# Altium project PCB-Tester-Board.PrjPcb (part 1 of 4)
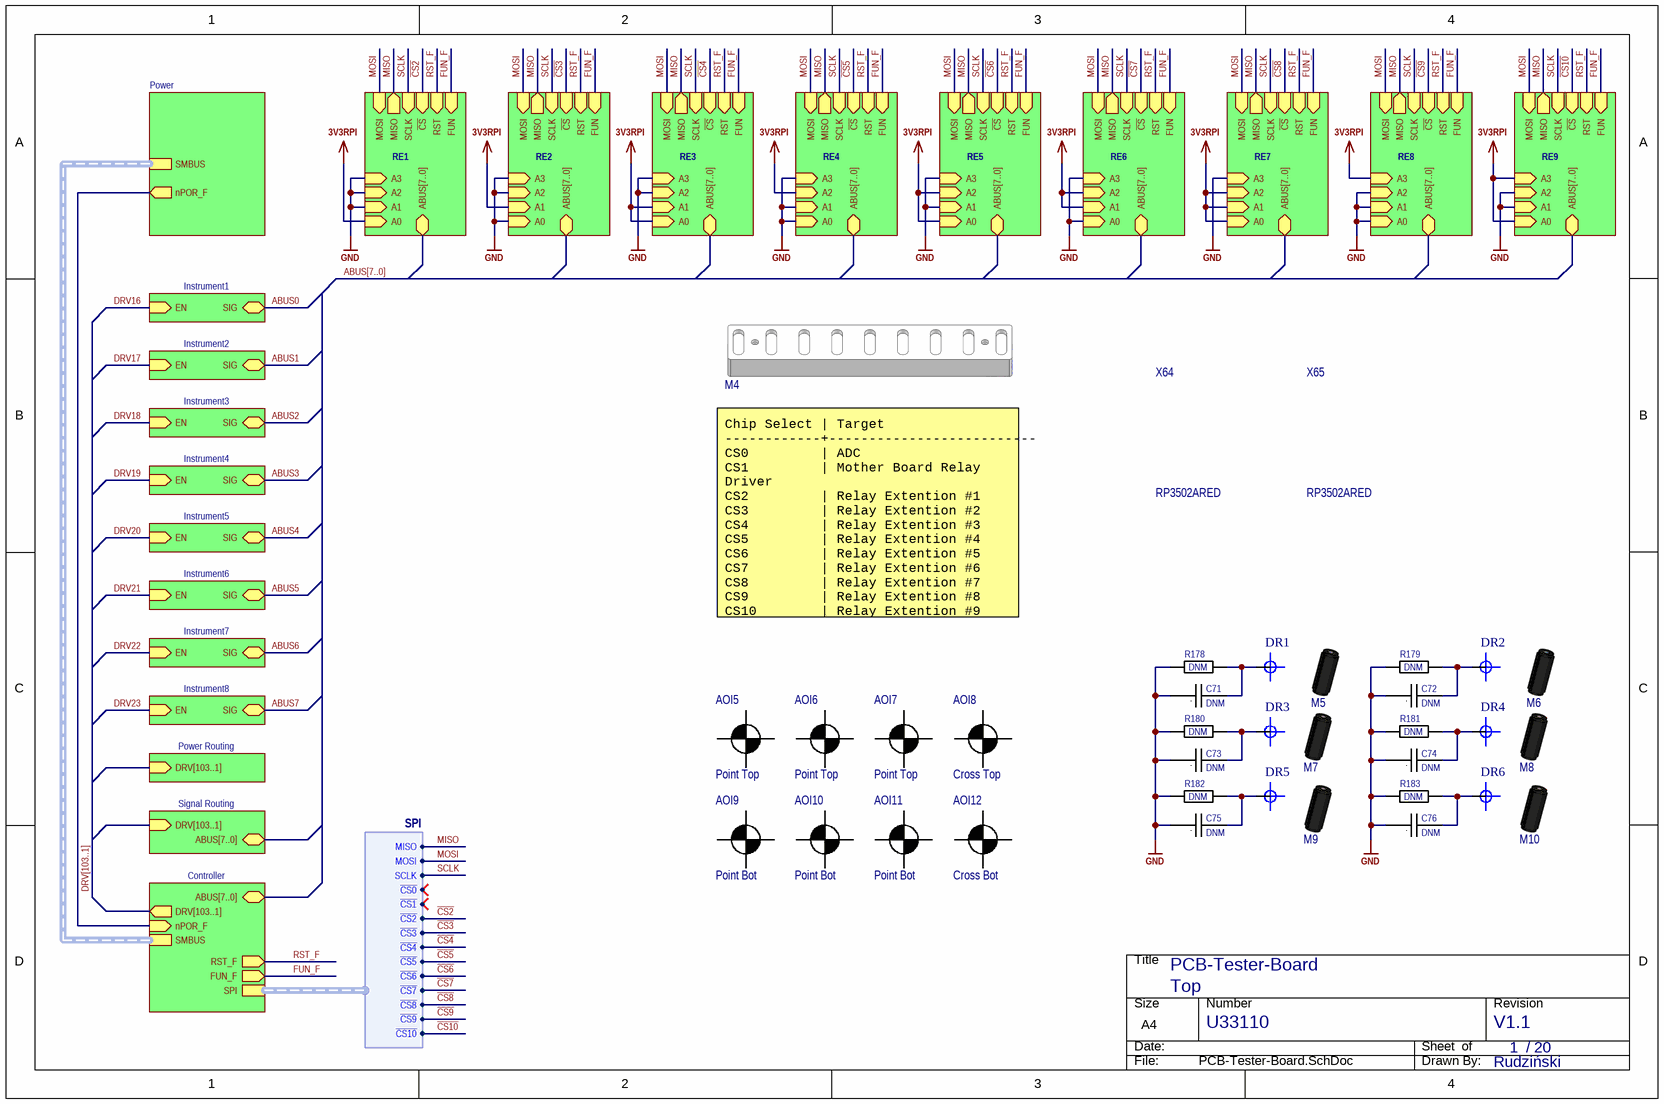
[diagram p0: PCB-Tester-Board.SchDoc]
Project_Team: Semi-ATE; Project_Revision: V1.1; Project_Repository: https://github.com/Semi-ATE/PCB-Tester; Project_Number: U33110; Project_Name: PCB-Tester-Board; Project_Engineer: Hören; Project_DrawnBy: Rudziński; Project_CheckedBy: Mörz
20 sheets, 790 parts. Net scope: hierarchical (ports join the sheet entries above them; power ports are global).
Board file: PCB-Tester-Board.PcbDoc
Sheets:
  PCB-Tester-Board.SchDoc
    Instrument1 = Instrument.SchDoc
    Instrument2 = Instrument.SchDoc
    Instrument3 = Instrument.SchDoc
    Instrument4 = Instrument.SchDoc
    Instrument5 = Instrument.SchDoc
    Instrument6 = Instrument.SchDoc
    Instrument7 = Instrument.SchDoc
    Instrument8 = Instrument.SchDoc
    Power = Power.SchDoc
      PSU2 = PSU2.SchDoc
      PSU1 = PSU1.SchDoc
      PSU3 = PSU3.SchDoc
      DC Cable = DC-Cable.SchDoc
      AC Cables = AC-Cable.SchDoc
    RE2 = RelayExtension.SchDoc
    Controller = Controller.SchDoc
      ADC = ADC.SchDoc
      RelayDriver = RelayDriver.SchDoc
        X7A15T-Prog = X7A15T-Prog.SchDoc
        X7A15T-Fabric = X7A15T-Fabric.SchDoc
        X7A15T-Power = X7A15T-Power.SchDoc
          X7A15T-Decoupling = X7A15T-Decoupling.SchDoc
      Input = Input.SchDoc
      Output = Output.SchDoc
      Output = Output.SchDoc
      Output = Output.SchDoc
      Output = Output.SchDoc
      Output = Output.SchDoc
      Input = Input.SchDoc
      Input = Input.SchDoc
      Input = Input.SchDoc
      Input = Input.SchDoc
    RE3 = RelayExtension.SchDoc
    RE4 = RelayExtension.SchDoc
    RE5 = RelayExtension.SchDoc
    RE6 = RelayExtension.SchDoc
    RE7 = RelayExtension.SchDoc
    RE8 = RelayExtension.SchDoc
    RE1 = RelayExtension.SchDoc
    RE9 = RelayExtension.SchDoc
    Power Routing = PowerRouting.SchDoc
    Signal Routing = SignalRouting.SchDoc

## Sheet PCB-Tester-Board.SchDoc: Top
size A4; Date: JUN 2020; ApprovedBy: Hören; CheckedBy: Mörz; Author: Rudziński; CompanyName: Semi-ATE; DrawnBy: Rudziński; Engineer: Hören; Organization: Semi-ATE; DocumentNumber: 1; Revision: V1.0; SheetNumber: 1; SheetTotal: 20

### Parts
AOI5  Shape: Point Top  [Fiducial Point]  (hidden comment: AOI)  (no BOM)
AOI6  Shape: Point Top  [Fiducial Point]  (hidden comment: AOI)  (no BOM)
AOI7  Shape: Point Top  [Fiducial Point]  (hidden comment: AOI)  (no BOM)
AOI8  Shape: Cross Top  [Fiducial Cross]  (hidden comment: AOI)  (no BOM)
AOI9  Shape: Point Bot  [Fiducial Point]  (hidden comment: AOI)  (no BOM)
AOI10  Shape: Point Bot  [Fiducial Point]  (hidden comment: AOI)  (no BOM)
AOI11  Shape: Point Bot  [Fiducial Point]  (hidden comment: AOI)  (no BOM)
AOI12  Shape: Cross Bot  [Fiducial Cross]  (hidden comment: AOI)  (no BOM)
C71  value DNM  [C1206 Reflow]  (hidden comment: C)  (no BOM)
C72  value DNM  [C1206 Reflow]  (hidden comment: C)  (no BOM)
C73  value DNM  [C1206 Reflow]  (hidden comment: C)  (no BOM)
C74  value DNM  [C1206 Reflow]  (hidden comment: C)  (no BOM)
C75  value DNM  [C1206 Reflow]  (hidden comment: C)  (no BOM)
C76  value DNM  [C1206 Reflow]  (hidden comment: C)  (no BOM)
DR1  X  [HOLE_3.4mm]  (value not drawn)  (no BOM)
DR2  X  [HOLE_3.4mm]  (value not drawn)  (no BOM)
DR3  X  [HOLE_3.4mm]  (value not drawn)  (no BOM)
DR4  X  [HOLE_3.4mm]  (value not drawn)  (no BOM)
DR5  X  [HOLE_3.4mm]  (value not drawn)  (no BOM)
DR6  X  [HOLE_3.4mm]  (value not drawn)  (no BOM)
M4  M  (value not drawn)  (mechanical)
M5  M  [970180155]  (value not drawn)
M6  M  [970180155]  (value not drawn)
M7  M  [970180155]  (value not drawn)
M8  M  [970180155]  (value not drawn)
M9  M  [970180155]  (value not drawn)
M10  M  [970180155]  (value not drawn)
R178  value DNM  [R1206 Reflow]  (hidden comment: R)  (no BOM)
R179  value DNM  [R1206 Reflow]  (hidden comment: R)  (no BOM)
R180  value DNM  [R1206 Reflow]  (hidden comment: R)  (no BOM)
R181  value DNM  [R1206 Reflow]  (hidden comment: R)  (no BOM)
R182  value DNM  [R1206 Reflow]  (hidden comment: R)  (no BOM)
R183  value DNM  [R1206 Reflow]  (hidden comment: R)  (no BOM)
X64  X  (value not drawn)
X65  X  (value not drawn)

### Sub-sheets
Controller = Controller.SchDoc: ABUS[7..0] (bidir), SPI (harness SPI), DRV[103..1] (out), SMBUS (harness SMBUS), nPOR_F (in), FUN_F (out), RST_F (out)
Instrument1 = Instrument.SchDoc: EN (in), SIG (bidir)
Instrument2 = Instrument.SchDoc: EN (in), SIG (bidir)
Instrument3 = Instrument.SchDoc: EN (in), SIG (bidir)
Instrument4 = Instrument.SchDoc: EN (in), SIG (bidir)
Instrument5 = Instrument.SchDoc: EN (in), SIG (bidir)
Instrument6 = Instrument.SchDoc: EN (in), SIG (bidir)
Instrument7 = Instrument.SchDoc: EN (in), SIG (bidir)
Instrument8 = Instrument.SchDoc: EN (in), SIG (bidir)
Power = Power.SchDoc: SMBUS (harness SMBUS), nPOR_F (out)
Power Routing = PowerRouting.SchDoc: DRV[103..1] (in)
RE1 = RelayExtension.SchDoc: ABUS[7..0] (bidir), SCLK (in), ~{CS} (in), MISO (out), MOSI (in), A3 (in), A2 (in), A1 (in), A0 (in), RST (in), FUN (in)
RE2 = RelayExtension.SchDoc: ABUS[7..0] (bidir), MOSI (in), MISO (out), ~{CS} (in), SCLK (in), A2 (in), A3 (in), A1 (in), A0 (in), RST (in), FUN (in)
RE3 = RelayExtension.SchDoc: ABUS[7..0] (bidir), MISO (out), SCLK (in), ~{CS} (in), MOSI (in), A2 (in), A3 (in), A1 (in), A0 (in), RST (in), FUN (in)
RE4 = RelayExtension.SchDoc: ABUS[7..0] (bidir), ~{CS} (in), SCLK (in), MOSI (in), MISO (out), A0 (in), A1 (in), A2 (in), A3 (in), RST (in), FUN (in)
RE5 = RelayExtension.SchDoc: ABUS[7..0] (bidir), SCLK (in), MISO (out), MOSI (in), ~{CS} (in), A3 (in), A2 (in), A1 (in), A0 (in), RST (in), FUN (in)
RE6 = RelayExtension.SchDoc: ABUS[7..0] (bidir), MOSI (in), ~{CS} (in), MISO (out), SCLK (in), A3 (in), A0 (in), A1 (in), A2 (in), RST (in), FUN (in)
RE7 = RelayExtension.SchDoc: ABUS[7..0] (bidir), MOSI (in), SCLK (in), MISO (out), ~{CS} (in), A0 (in), A1 (in), A2 (in), A3 (in), RST (in), FUN (in)
RE8 = RelayExtension.SchDoc: ABUS[7..0] (bidir), MOSI (in), MISO (out), ~{CS} (in), SCLK (in), A3 (in), A2 (in), A1 (in), A0 (in), RST (in), FUN (in)
RE9 = RelayExtension.SchDoc: ABUS[7..0] (bidir), MISO (out), SCLK (in), MOSI (in), ~{CS} (in), A3 (in), A2 (in), A1 (in), A0 (in), RST (in), FUN (in)
Signal Routing = SignalRouting.SchDoc: ABUS[7..0] (bidir), DRV[103..1] (in)

### Harnesses
SPI: MISO, MOSI, SCLK, ~{CS0}, ~{CS1}, ~{CS2}, ~{CS3}, ~{CS4}, ~{CS5}, ~{CS6}, ~{CS7}, ~{CS8}, ~{CS9}, ~{CS10}

### Nets
3V3RPI: sheet RE2/A1, sheet RE3/A1, sheet RE3/A0, sheet RE4/A2, sheet RE5/A2, sheet RE5/A0, sheet RE6/A1, sheet RE6/A2, sheet RE7/A0, sheet RE7/A1, sheet RE7/A2, sheet RE8/A3, sheet RE1/A0, sheet RE9/A3, sheet RE9/A0
GND: C71.1 C72.1 C73.1 C74.1 C75.1 C76.1 R178.2 R179.2 R180.2 R181.2 R182.2 R183.2 ; sheet RE2/A2, sheet RE2/A3, sheet RE2/A0, sheet RE3/A2, sheet RE3/A3, sheet RE4/A0, sheet RE4/A1, sheet RE4/A3, sheet RE5/A3, sheet RE5/A1, sheet RE6/A3, sheet RE6/A0, sheet RE7/A3, sheet RE8/A2, sheet RE8/A1, sheet RE8/A0, sheet RE1/A3, sheet RE1/A2, sheet RE1/A1, sheet RE9/A2, sheet RE9/A1
~{CS2}: sheet RE1/~{CS}, sheet Controller/SPI.~{CS2}
~{CS3}: sheet RE2/~{CS}, sheet Controller/SPI.~{CS3}
~{CS4}: sheet RE3/~{CS}, sheet Controller/SPI.~{CS4}
~{CS5}: sheet RE4/~{CS}, sheet Controller/SPI.~{CS5}
~{CS6}: sheet RE5/~{CS}, sheet Controller/SPI.~{CS6}
~{CS7}: sheet RE6/~{CS}, sheet Controller/SPI.~{CS7}
~{CS8}: sheet RE7/~{CS}, sheet Controller/SPI.~{CS8}
~{CS9}: sheet RE8/~{CS}, sheet Controller/SPI.~{CS9}
~{CS10}: sheet RE9/~{CS}, sheet Controller/SPI.~{CS10}
FUN_F: sheet RE2/FUN, sheet Controller/FUN_F, sheet RE3/FUN, sheet RE4/FUN, sheet RE5/FUN, sheet RE6/FUN, sheet RE7/FUN, sheet RE8/FUN, sheet RE1/FUN, sheet RE9/FUN
MISO: sheet RE2/MISO, sheet RE3/MISO, sheet RE4/MISO, sheet RE5/MISO, sheet RE6/MISO, sheet RE7/MISO, sheet RE8/MISO, sheet RE1/MISO, sheet RE9/MISO, sheet Controller/SPI.MISO
MOSI: sheet RE2/MOSI, sheet RE3/MOSI, sheet RE4/MOSI, sheet RE5/MOSI, sheet RE6/MOSI, sheet RE7/MOSI, sheet RE8/MOSI, sheet RE1/MOSI, sheet RE9/MOSI, sheet Controller/SPI.MOSI
nRST: sheet Power/nPOR_F, sheet Controller/nPOR_F
RST_F: sheet RE2/RST, sheet Controller/RST_F, sheet RE3/RST, sheet RE4/RST, sheet RE5/RST, sheet RE6/RST, sheet RE7/RST, sheet RE8/RST, sheet RE1/RST, sheet RE9/RST
SCLK: sheet RE2/SCLK, sheet RE3/SCLK, sheet RE4/SCLK, sheet RE5/SCLK, sheet RE6/SCLK, sheet RE7/SCLK, sheet RE8/SCLK, sheet RE1/SCLK, sheet RE9/SCLK, sheet Controller/SPI.SCLK
NetC71_2: C71.2 DR1.1(OUT3) R178.1
NetC72_2: C72.2 DR2.1(OUT3) R179.1
NetC73_2: C73.2 DR3.1(OUT3) R180.1
NetC74_2: C74.2 DR4.1(OUT3) R181.1
NetC75_2: C75.2 DR5.1(OUT3) R182.1
NetC76_2: C76.2 DR6.1(OUT3) R183.1

### Buses and harness runs
bus ABUS[7..0] = sheet Controller/ABUS[7..0] = sheet RE1/ABUS[7..0] = sheet RE2/ABUS[7..0] = sheet RE3/ABUS[7..0] = sheet RE4/ABUS[7..0] = sheet RE5/ABUS[7..0] = sheet RE6/ABUS[7..0] = sheet RE7/ABUS[7..0] = sheet RE8/ABUS[7..0] = sheet RE9/ABUS[7..0] = sheet Signal Routing/ABUS[7..0]
bus DRV[103..1] = sheet Controller/DRV[103..1] = sheet Power Routing/DRV[103..1] = sheet Signal Routing/DRV[103..1]
harness sheet Controller/SMBUS = sheet Power/SMBUS

### Notes on the sheet
- (near M4) Chip Select | Target
  ------------+--------------------------
  CS0         | ADC
  CS1         | Mother Board Relay Driver
  CS2         | Relay Extention #1
  CS3         | Relay Extention #2
  CS4         | Relay Extention #3
  CS5         | Relay Extention #4
  CS6         | Relay Extention #5
  CS7         | Relay Extention #6
  CS8         | Relay Extention #7
  CS9         | Relay Extention #8
  CS10        | Relay Extention #9
- /
- designed by
- reviewed by
- last drawn by
- Project:
- Schematic:
- last printed
- DIN-A4 L
- sheets
- of
- File:
- (in symbol C) .

### Library data of the parts
AOI5-AOI12 = Fiducial: Assembly AOI; 13. Created Date/Name: AUG2018/Hören; 01. Distributor: N/A; 02. Distributor Part Number: N/A; 03. Unit Price: N/A; 04. Manufacturer: N/A; 05. Quantity: N/A; 06. Data Sheet: N/A; 07. Manufacturer  Part Number: N/A; 08. Inhouse Stock: N/A; 09. Operating Temperature: N/A; 10. Weight: N/A; 11. RoHS: N/A; 12.UL94 Flammability: N/A; ComponentLink1Description: Info; ComponentLink2Description: Info
C71-C76 = C: Capacitor Unpolarized; Tolerance: ±20%; 13. Created Date/Name: AUG2018/Hören; ComponentLink1Description: Info; ComponentLink1URL: *; 09. Operating Temperature: -xx..+yy°C; 11. RoHS: ???; ComponentLink2Description: DataSheet
DR1-DR6 = Drill-3.2mm-M3-C: Fiducal 90 mil; POPULATED: no part
M4 = Support Block: 03. Unit Price: 2.0; 13. Created Date/Name: ??? / Hören; System: Connector; 01. Distributor: Likom; 02. Distributor Part Number: N/A; 04. Manufacturer: N/A; 07. Manufacturer  Part Number: N/A; ComponentLink1Description: Info; ComponentLink2Description: DataSheet
M5-M10 = Spacer 18mm Plastic: PLASTIC SPACER STUD METRIC THREA; 04. Manufacturer: Würth Elektronik; 03. Unit Price: 0.92; 13. Created Date/Name: ??? / Hören; System: Connector; 01. Distributor: DigiKey; 02. Distributor Part Number: 732-13017-ND; 07. Manufacturer  Part Number: 970180155; ComponentLink1Description: Info; ComponentLink1URL: https://www.digikey.de/products/de?keywords=970180155; ComponentLink2Description: DataSheet; ComponentLink2URL: https://www.we-online.de/katalog/datasheet/970xxxxxx_overall.pdf
R178-R183 = R: Resistor; Tolerance: ±1%; 13. Created Date/Name: AUG2018/Hören; ComponentLink1URL: *; ComponentLink1Description: Info; 09. Operating Temperature: -xx..+yy°C; 11. RoHS: ???; ComponentLink2Description: DataSheet; Package: *
X64 X65 = RP3502ARED: SWITCH PUSH SPST-NO 3A 120V; 04. Manufacturer: E-Switch; 03. Unit Price: 1.54; 13. Created Date/Name: AUG 2018 / Hören; 01. Distributor: DigiKey; 02. Distributor Part Number: EG1930-ND; 11. RoHS: YES; ComponentLink1Description: Info; ComponentLink1URL: https://www.digikey.de/product-detail/en/e-switch/RP3502ARED/EG1930-ND/280448; ComponentLink2Description: DataSheet; ComponentLink2URL: https://media.digikey.com/pdf/Data%20Sheets/E-Switch%20PDFs/RP3502_Series.pdf; 07. Manufacturer  Part Number: RP3502ARED

## Sheet Instrument.SchDoc: Instrument
size A4; Date: JUN 2020; ApprovedBy: Hören; CheckedBy: Mörz; Author: Rudziński; CompanyName: Semi-ATE; DrawnBy: Rudziński; Engineer: Hören; Organization: Semi-ATE; DocumentNumber: 3; Revision: V1.0; SheetNumber: 3; SheetTotal: 20
Used 8 times, as channels Instrument1, Instrument2, Instrument3, Instrument4, Instrument5, Instrument6, Instrument7, Instrument8. Parts and nets are listed once, with the designators drawn on the sheet.
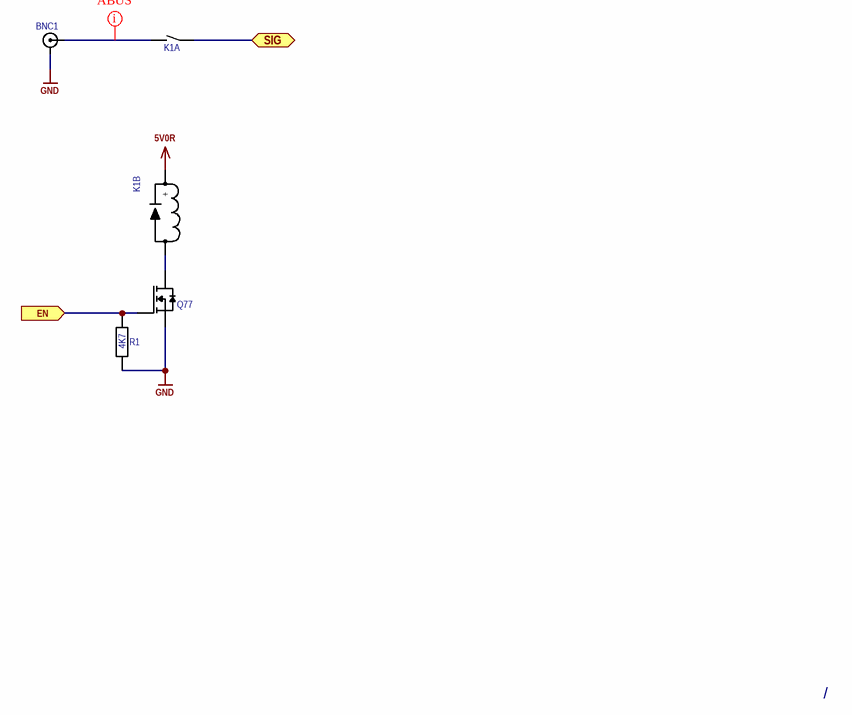
[diagram p1: Instrument.SchDoc]

### Parts
BNC1  X  [BNC]  (value not drawn)
K1  K  [118-1A]  (value not drawn)  (parts A,B of 2)
Q77  Q  [SOT23-3]  (value not drawn)
R1  value 4K7  [R0603 Reflow]  (hidden comment: R)

### Ports
EN (in), SIG (bidir)

### Nets
5V0R: K1.1(+)
GND: BNC1.0 Q77.2(S) R1.1
EN: Q77.1(G) R1.2 ; port EN
SIG: K1.4(CB) ; port SIG
NetBNC1_1: BNC1.1 K1.3(CA)
NetK1_2: K1.2(-) Q77.3(D)

### Channels
Instrument1: designators end in _1; ports EN=DRV16 SIG=ABUS0
Instrument2: designators end in _2; ports EN=DRV17 SIG=ABUS1
Instrument3: designators end in _3; ports EN=DRV18 SIG=ABUS2
Instrument4: designators end in _4; ports EN=DRV19 SIG=ABUS3
Instrument5: designators end in _5; ports EN=DRV20 SIG=ABUS4
Instrument6: designators end in _6; ports EN=DRV21 SIG=ABUS5
Instrument7: designators end in _7; ports EN=DRV22 SIG=ABUS6
Instrument8: designators end in _8; ports EN=DRV23 SIG=ABUS7

### Layout directives
net class ABUS: NetBNC1_1_1

### Notes on the sheet
- /
- designed by
- reviewed by
- last drawn by
- Project:
- Schematic:
- last printed
- DIN-A4 L
- sheets
- of
- File:

### Library data of the parts
BNC1 = BNC: BNC Connector; 04. Manufacturer: Amphenol RF; 07. Manufacturer  Part Number: 112778; 03. Unit Price: 11.91; 13. Created Date/Name: AUG 2018 / Hören; ComponentLink1Description: Info; 02. Distributor Part Number: ACX1985-ND; 01. Distributor: DigiKey; ComponentLink2Description: DataSheet; ComponentLink3Description: FootPrint; System: Connector
K1 = 118-1-A-5/2D: 5V Signal Relais, Normal Open; 04. Manufacturer: Pickering; 03. Unit Price: 2.60; 05. Quantity: 1000; 06. Data Sheet: Pickering_series_118.pdf; 13. Created Date/Name: 20.12.17 S. Kaiser; Coil Resistance: 1500 Ohm; Max Carry Current: 1.2 A; Max Switch Current: 1A; Max Switch Voltage: 200V; Power Rating: 15W; 01. Distributor: Pickering; 02. Distributor Part Number: 118-1-A-5/2D; 07. Manufacturer  Part Number: 118-1-A-5/2D; 09. Operating Temperature: -20°C ~ +85°C; 11. RoHS: 2011/65/EU; ComponentLink1Description: Info; ComponentLink1URL: http://www.pickeringrelay.com/; ComponentLink2Description: DataSheet; ComponentLink2URL: https://www.pickeringrelay.com/products/single-line-sil-series-111-119/single-line-sil-series-118/; Coil Voltage: 5V
Q77 = FDV303N: MOSFET N-CH 25V 680MA SOT-23; 04. Manufacturer: ON Semiconductor; 03. Unit Price: 0.41; 13. Created Date/Name: AUG 2018 / Hören; Rds On: 450 mΩ @ id=500mA & Vgs=4.5V; Vgs,th: 1.5V @ 250uA; Power Rating: 350mW; 3D-Export: No; 01. Distributor: DigiKey; 02. Distributor Part Number: FDV303NDKR-ND; 07. Manufacturer  Part Number: FDV303N; 09. Operating Temperature: -55°C ~ 150°C (TJ); 11. RoHS: YES; ComponentLink1Description: Info; ComponentLink1URL: https://www.digikey.de/product-detail/en/on-semiconductor/FDV303N/FDV303NDKR-ND/1630434; ComponentLink2Description: DataSheet; ComponentLink2URL: https://media.digikey.com/pdf/Data%20Sheets/Fairchild%20PDFs/FDV303N.pdf; Vdss: 25V; Id: 680mA
R1 = R: RES SMD 4.7K OHM 1% 1/10W 0603; 04. Manufacturer: Yageo; 07. Manufacturer  Part Number: RC0603FR-074K7L; 03. Unit Price: 0.09; 13. Created Date/Name: AUG2018/Hören; Tolerance: ±1%; ComponentLink1URL: *; ComponentLink1Description: Info; 02. Distributor Part Number: 311-4.70KHRCT-ND; 09. Operating Temperature: -xx..+yy°C; 11. RoHS: ???; 01. Distributor: DigiKey; ComponentLink2Description: DataSheet; Package: *

## Sheet Power.SchDoc: Power
size A4; Date: JUN 2020; ApprovedBy: Hören; CheckedBy: Mörz; Author: Rudziński; CompanyName: Semi-ATE; DrawnBy: Rudziński; Engineer: Hören; Organization: Semi-ATE; DocumentNumber: 4; Revision: V1.0; SheetNumber: 4; SheetTotal: 20
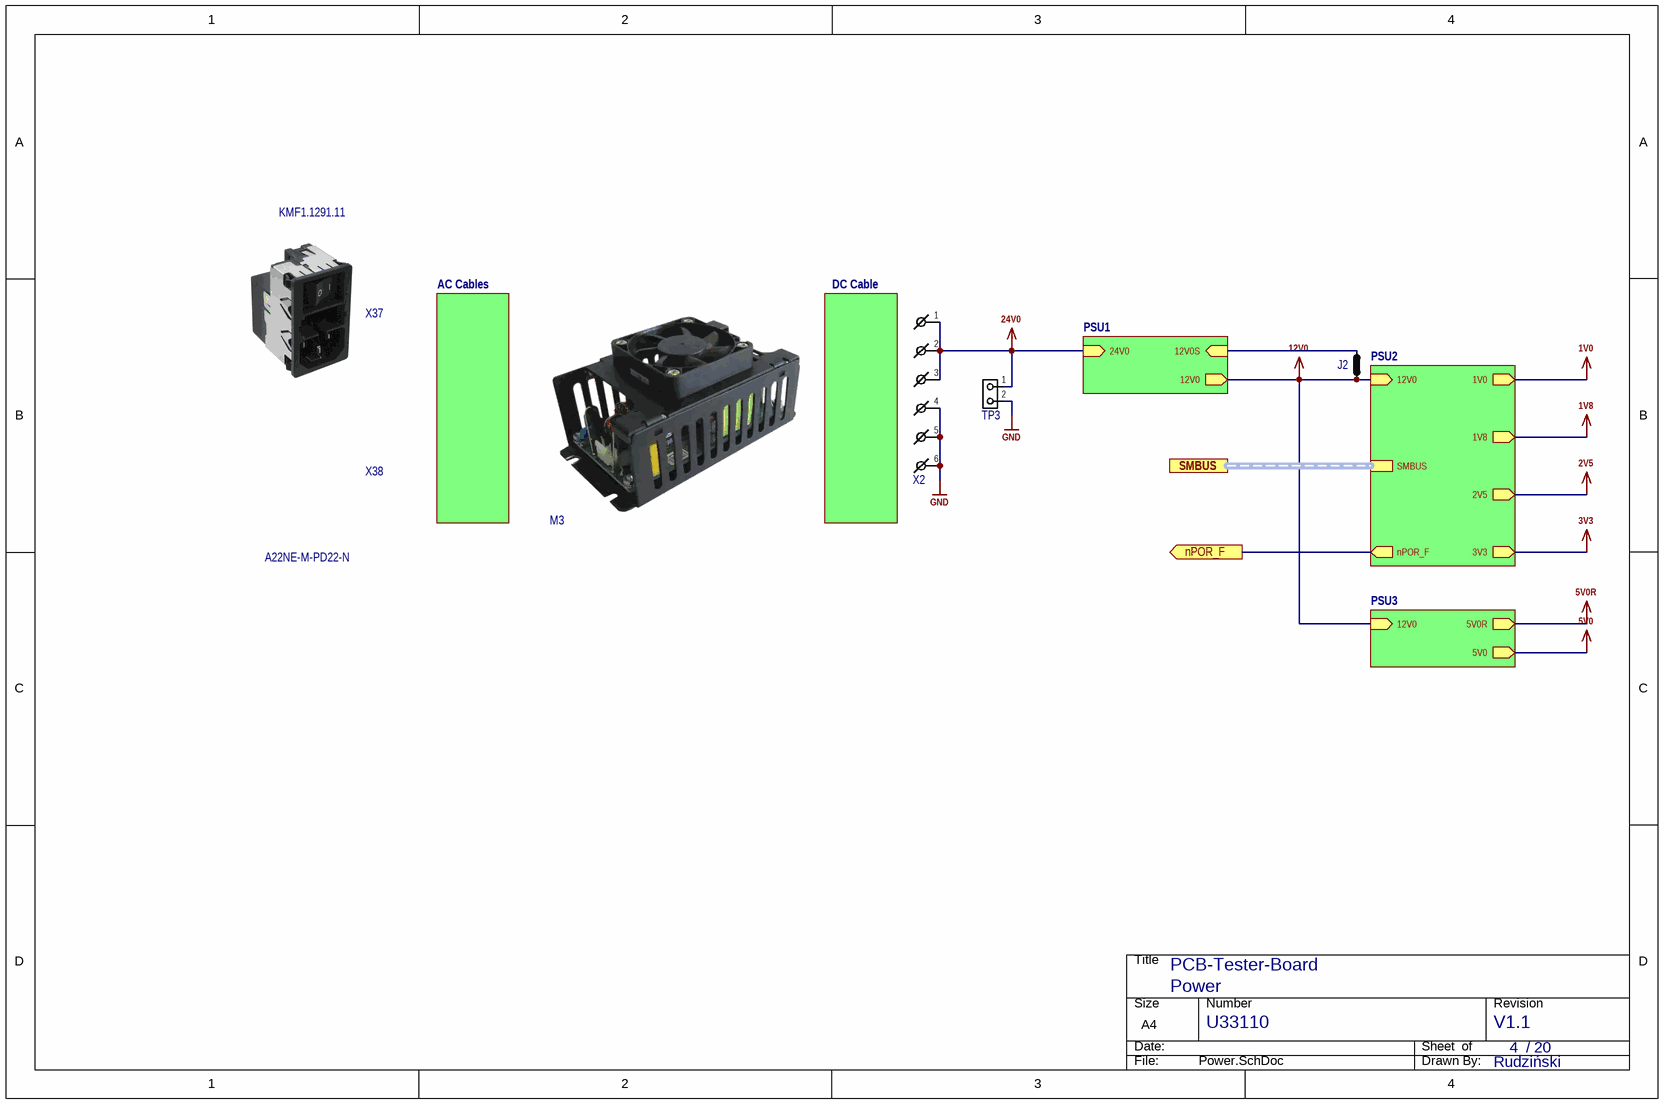
[diagram p2: Power.SchDoc]

### Parts
J2  J  [NT0201]  (value not drawn)  (net tie, no BOM)
M3  M  (value not drawn)  (mechanical)
TP3  TP  [DualTestpoint 100mils]  (value not drawn)  (no BOM)
X2  X  [B6PS-VH]  (value not drawn)
X37  07. Manufacturer  Part Number: KMF1.1291.11  (hidden comment: X)
X38  X  (value not drawn)

### Sub-sheets
AC Cables = AC-Cable.SchDoc: no entries
DC Cable = DC-Cable.SchDoc: no entries
PSU1 = PSU1.SchDoc: 12V0 (out), 12V0S (in), 24V0 (in)
PSU2 = PSU2.SchDoc: 12V0 (in), 3V3 (out), 1V0 (out), 1V8 (out), 2V5 (out), SMBUS (harness SMBUS), nPOR_F (out)
PSU3 = PSU3.SchDoc: 12V0 (in), 5V0R (out), 5V0 (out)

### Ports
nPOR_F (out), SMBUS (harness SMBUS)

### Nets
12V0: J2.1 ; sheet PSU2/12V0, sheet PSU1/12V0, sheet PSU3/12V0
24V0: TP3.1 X2.1 X2.2 X2.3 ; sheet PSU1/24V0
GND: TP3.2 X2.4 X2.5 X2.6
nRST: port nPOR_F, sheet PSU2/nPOR_F
P12V0D_S: J2.2 ; sheet PSU1/12V0S

### Buses and harness runs
harness port SMBUS = sheet PSU2/SMBUS

### Notes on the sheet
- /
- designed by
- reviewed by
- last drawn by
- Project:
- Schematic:
- last printed
- DIN-A4 L
- sheets
- of
- File:
- (in symbol C) .

### Library data of the parts
J2 = NT: Net Tie; 13. Created Date/Name: AUG2018/Hören; 01. Distributor: N/A; 02. Distributor Part Number: N/A; 03. Unit Price: N/A; 04. Manufacturer: N/A; 05. Quantity: N/A; 06. Data Sheet: N/A; 07. Manufacturer  Part Number: N/A; 08. Inhouse Stock: N/A; 09. Operating Temperature: N/A; 10. Weight: N/A; 11. RoHS: N/A; 12.UL94 Flammability: N/A; ComponentLink1Description: Info; ComponentLink2Description: DataSheet
M3 = CUS150M-24/F: AC DC CONVERTER 85~264VAC --> 24VDC (6A); 04. Manufacturer: TDK-Lambda Americas Inc.; 07. Manufacturer  Part Number: CUS150M24/F; 03. Unit Price: 87.85; 13. Created Date/Name: AUG 2018 / Hören; 01. Distributor: DigiKey; 02. Distributor Part Number: 285-3030-ND; 09. Operating Temperature: -20°C ~ 85°C; 11. RoHS: YES; ComponentLink1Description: Info; ComponentLink1URL: https://www.digikey.de/product-detail/en/tdk-lambda-americas-inc/CUS150M24-F/285-3030-ND/7695382?cur=EUR&lang=en; ComponentLink2Description: DataSheet; ComponentLink2URL: https://product.tdk.com/info/en/catalog/datasheets/cus150m_e.pdf
TP3 = DualTestpoint 100mils: Dual testpoint, pitch 2.54mm; 04. Manufacturer: Samtec Inc.; 07. Manufacturer  Part Number: HMTSW-103-07-G-S-240; 03. Unit Price: 0.25; 13. Created Date/Name: AUG2018/Hören; 01. Distributor: Samtec Inc.; 02. Distributor Part Number: HMTSW-103-07-G-S-240; 11. RoHS: YES; ComponentLink1Description: Info; ComponentLink1URL: https://www.samtec.com/products/hmtsw-103-07-g-s-240; ComponentLink2Description: DataSheet; ComponentLink2URL: http://suddendocs.samtec.com/catalog_english/hmtsw.pdf
X2 = B6PS-VH: CONN HEADER R/A 6POS 3.96MM; 04. Manufacturer: JST Sales America Inc.; 07. Manufacturer  Part Number: B6PS-VH(LF)(SN); 03. Unit Price: 0.38; 13. Created Date/Name: AUG 2018 / Hören; System: Connector; 01. Distributor: DigiKey; 02. Distributor Part Number: 455-1652-ND; 09. Operating Temperature: -25°C ~ 85°C; 11. RoHS: YES; ComponentLink1Description: Info; ComponentLink1URL: https://www.digikey.de/product-detail/en/jst-sales-america-inc/B6PS-VH-LF-SN/455-1652-ND/926559; ComponentLink2Description: DataSheet; ComponentLink2URL: http://www.jst-mfg.com/product/pdf/eng/eVH.pdf
X37 = KMF1-1291-11: PWR ENT MOD RCPT IEC320-C14 PNL; 04. Manufacturer: Schurter Inc.; 03. Unit Price: 15.81; 13. Created Date/Name: AUG 2018 / Hören; 01. Distributor: DigiKey; 02. Distributor Part Number: 486-2292-ND; 11. RoHS: YES; ComponentLink1Description: Info; ComponentLink1URL: https://www.digikey.de/product-detail/en/schurter-inc/KMF1-1291-11/486-2292-ND/642117; ComponentLink2Description: DataSheet; ComponentLink2URL: https://us.schurter.com/bundles/snceschurter/epim/_ProdPool_/newDS/en/typ_KMF.pdf
X38 = A22NE-M-PD22-N: E-STOP 40MM 2NO/2NC TURN RESET; 04. Manufacturer: Omron Automation and Safety; 03. Unit Price: 61.54; 13. Created Date/Name: AUG 2018 / Hören; 01. Distributor: DigiKey; 02. Distributor Part Number: 236-A22NE-M-PD22-N-ND; 11. RoHS: YES; ComponentLink1Description: Info; ComponentLink1URL: https://www.digikey.de/products/en?keywords=A22NE-M-PD22-N; ComponentLink2Description: DataSheet; ComponentLink2URL: http://www.ia.omron.com/data_pdf/cat/a22ne-pd_a22ne-p_a22e_a263-e1_20_11_csm1265.pdf; 07. Manufacturer  Part Number: A22NE-M-PD22-N

## Sheet PSU2.SchDoc: PSU2
size A3; Date: JUN 2020; ApprovedBy: Hören; CheckedBy: Mörz; Author: Rudziński; CompanyName: Semi-ATE; DrawnBy: Rudziński; Engineer: Hören; Organization: Semi-ATE; DocumentNumber: 15; SheetNumber: 15; SheetTotal: 20
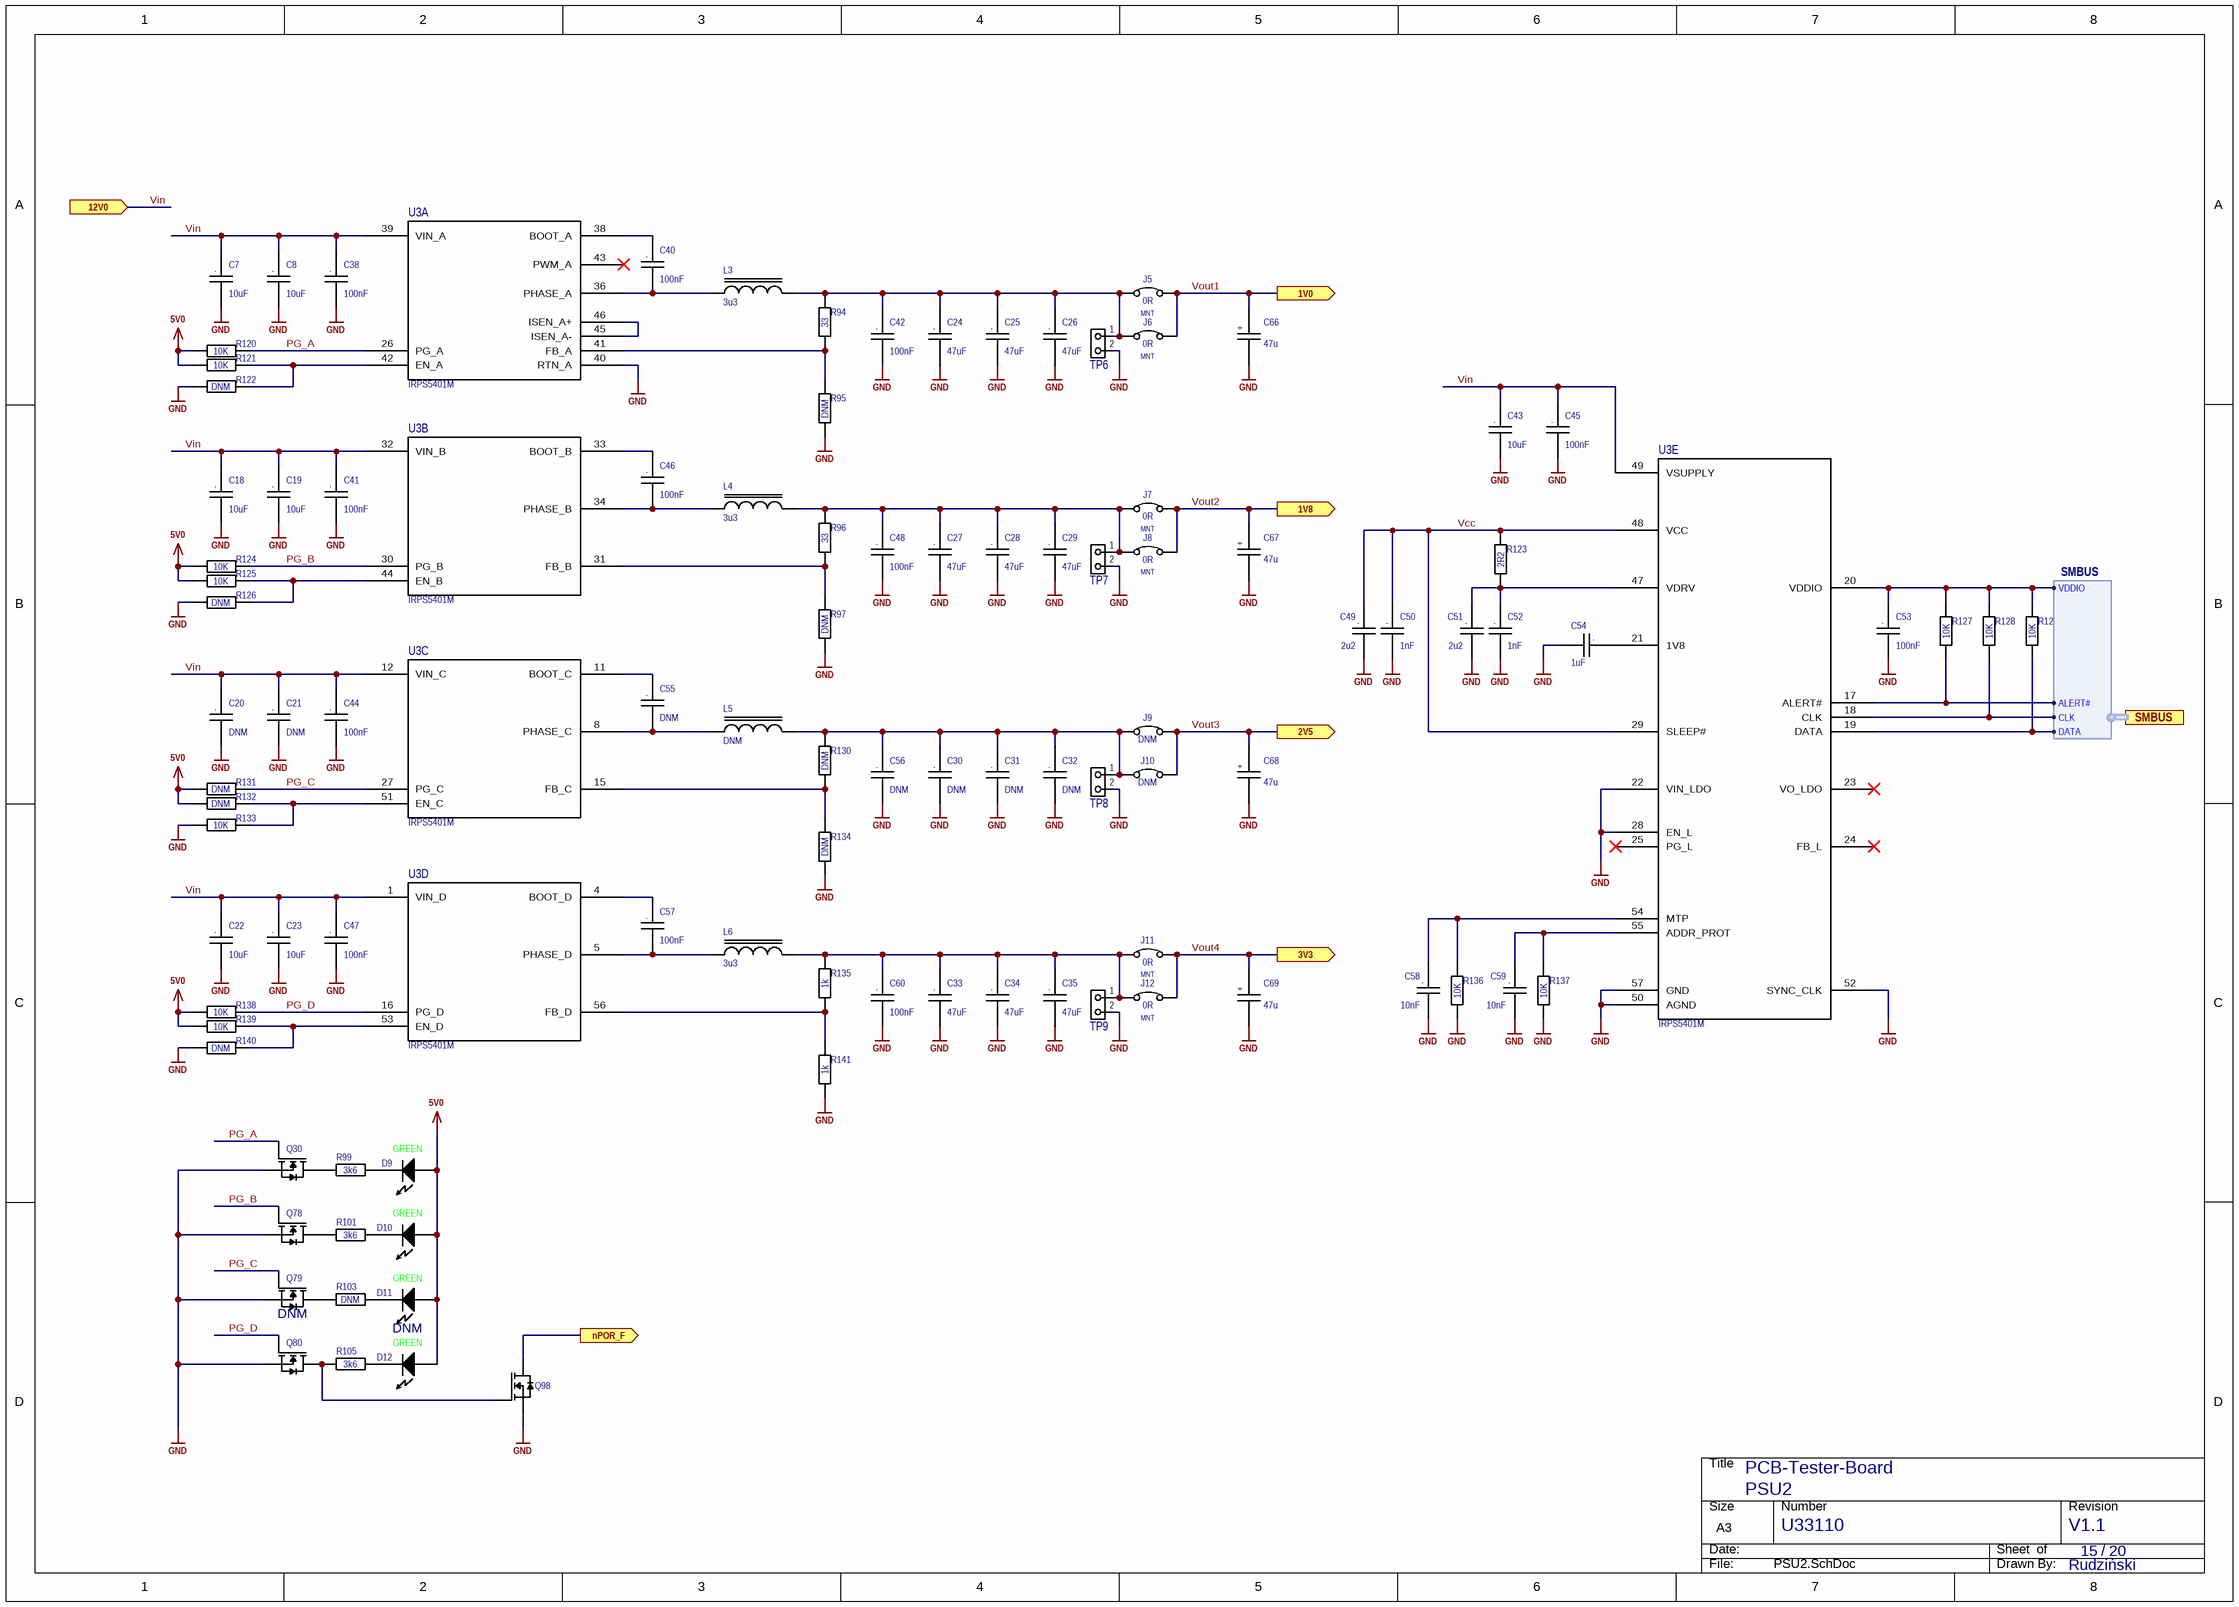
[diagram p3: PSU2.SchDoc]

### Parts
C7  value 10uF  [C1206 Reflow]  (hidden comment: C)
C8  value 10uF  [C1206 Reflow]  (hidden comment: C)
C18  value 10uF  [C1206 Reflow]  (hidden comment: C)
C19  value 10uF  [C1206 Reflow]  (hidden comment: C)
C20  value DNM  [C1206 Reflow]  (hidden comment: C)  (no BOM)
C21  value DNM  [C1206 Reflow]  (hidden comment: C)  (no BOM)
C22  value 10uF  [C1206 Reflow]  (hidden comment: C)
C23  value 10uF  [C1206 Reflow]  (hidden comment: C)
C24  value 47uF  [C1210 Reflow]  (hidden comment: C)
C25  value 47uF  [C1210 Reflow]  (hidden comment: C)
C26  value 47uF  [C1210 Reflow]  (hidden comment: C)
C27  value 47uF  [C1210 Reflow]  (hidden comment: C)
C28  value 47uF  [C1210 Reflow]  (hidden comment: C)
C29  value 47uF  [C1210 Reflow]  (hidden comment: C)
C30  value DNM  [C1210 Reflow]  (hidden comment: C)  (no BOM)
C31  value DNM  [C1210 Reflow]  (hidden comment: C)  (no BOM)
C32  value DNM  [C1210 Reflow]  (hidden comment: C)  (no BOM)
C33  value 47uF  [C1210 Reflow]  (hidden comment: C)
C34  value 47uF  [C1210 Reflow]  (hidden comment: C)
C35  value 47uF  [C1210 Reflow]  (hidden comment: C)
C38  value 100nF  [C0402 Reflow]  (hidden comment: C)
C40  value 100nF  [C0402 Reflow]  (hidden comment: C)
C41  value 100nF  [C0402 Reflow]  (hidden comment: C)
C42  value 100nF  [C0402 Reflow]  (hidden comment: C)
C43  value 10uF  [C1206 Reflow]  (hidden comment: C)
C44  value 100nF  [C0402 Reflow]  (hidden comment: C)
C45  value 100nF  [C0402 Reflow]  (hidden comment: C)
C46  value 100nF  [C0402 Reflow]  (hidden comment: C)
C47  value 100nF  [C0402 Reflow]  (hidden comment: C)
C48  value 100nF  [C0402 Reflow]  (hidden comment: C)
C49  value 2u2  [C0805 Reflow]  (hidden comment: C)
C50  value 1nF  [C0402 Reflow]  (hidden comment: C)
C51  value 2u2  [C0805 Reflow]  (hidden comment: C)
C52  value 1nF  [C0402 Reflow]  (hidden comment: C)
C53  value 100nF  [C0402 Reflow]  (hidden comment: C)
C54  value 1uF  [C0402 Reflow]  (hidden comment: C)
C55  value DNM  [C0402 Reflow]  (hidden comment: C)  (no BOM)
C56  value DNM  [C0402 Reflow]  (hidden comment: C)  (no BOM)
C57  value 100nF  [C0402 Reflow]  (hidden comment: C)
C58  value 10nF  [C0402 Reflow]  (hidden comment: C)
C59  value 10nF  [C0402 Reflow]  (hidden comment: C)
C60  value 100nF  [C0402 Reflow]  (hidden comment: C)
C66  value 47u  [CAP_TAN_B]  (hidden comment: C+)
C67  value 47u  [CAP_TAN_B]  (hidden comment: C+)
C68  value 47u  [CAP_TAN_B]  (hidden comment: C+)
C69  value 47u  [CAP_TAN_B]  (hidden comment: C+)
D9  Color: GREEN  [L0603G]  (hidden comment: D)
D10  Color: GREEN  [L0603G]  (hidden comment: D)
D11  Color: GREEN  NicName: DNM  [L0603G]  (hidden comment: D)  (no BOM)
D12  Color: GREEN  [L0603G]  (hidden comment: D)
J5  value 0R  POPULATED: MNT  [JumperSMD]  (hidden comment: J)  (no BOM)
J6  value 0R  POPULATED: MNT  [JumperSMD]  (hidden comment: J)  (no BOM)
J7  value 0R  POPULATED: MNT  [JumperSMD]  (hidden comment: J)  (no BOM)
J8  value 0R  POPULATED: MNT  [JumperSMD]  (hidden comment: J)  (no BOM)
J9  value DNM  [JumperSMD]  (hidden comment: J)  (no BOM)
J10  value DNM  [JumperSMD]  (hidden comment: J)  (no BOM)
J11  value 0R  POPULATED: MNT  [JumperSMD]  (hidden comment: J)  (no BOM)
J12  value 0R  POPULATED: MNT  [JumperSMD]  (hidden comment: J)  (no BOM)
L3  Inductance: 3u3  [XAL7070]  (hidden comment: L)
L4  Inductance: 3u3  [XAL7070]  (hidden comment: L)
L5  Inductance: DNM  [XAL7070]  (hidden comment: L)  (no BOM)
L6  Inductance: 3u3  [XAL7070]  (hidden comment: L)
Q30  Q  [SOT23-3]  (value not drawn)
Q78  Q  [SOT23-3]  (value not drawn)
Q79  NicName: DNM  [SOT23-3]  (hidden comment: Q)  (no BOM)
Q80  Q  [SOT23-3]  (value not drawn)
Q98  Q  [SOT23-3]  (value not drawn)
R94  value 33  [R0402 Reflow]  (hidden comment: R)
R95  value DNM  [R0402 Reflow]  (hidden comment: R)  (no BOM)
R96  value 33  [R0402 Reflow]  (hidden comment: R)
R97  value DNM  [R0402 Reflow]  (hidden comment: R)  (no BOM)
R99  value 3k6  [R0603 Reflow]  (hidden comment: R)
R101  value 3k6  [R0603 Reflow]  (hidden comment: R)
R103  value DNM  [R0603 Reflow]  (hidden comment: R)  (no BOM)
R105  value 3k6  [R0603 Reflow]  (hidden comment: R)
R120  value 10K  [R0402 Reflow]  (hidden comment: R)
R121  value 10K  [R0402 Reflow]  (hidden comment: R)
R122  value DNM  [R0402 Reflow]  (hidden comment: R)  (no BOM)
R123  value 2R2  [R0402 Reflow]  (hidden comment: R)
R124  value 10K  [R0402 Reflow]  (hidden comment: R)
R125  value 10K  [R0402 Reflow]  (hidden comment: R)
R126  value DNM  [R0402 Reflow]  (hidden comment: R)  (no BOM)
R127  value 10K  [R0402 Reflow]  (hidden comment: R)
R128  value 10K  [R0402 Reflow]  (hidden comment: R)
R129  value 10K  [R0402 Reflow]  (hidden comment: R)
R130  value DNM  [R0402 Reflow]  (hidden comment: R)  (no BOM)
R131  value DNM  [R0402 Reflow]  (hidden comment: R)  (no BOM)
R132  value DNM  [R0402 Reflow]  (hidden comment: R)  (no BOM)
R133  value 10K  [R0402 Reflow]  (hidden comment: R)
R134  value DNM  [R0402 Reflow]  (hidden comment: R)  (no BOM)
R135  value 1k  [R0402 Reflow]  (hidden comment: R)
R136  value 10K  [R0402 Reflow]  (hidden comment: R)
R137  value 10K  [R0402 Reflow]  (hidden comment: R)
R138  value 10K  [R0402 Reflow]  (hidden comment: R)
R139  value 10K  [R0402 Reflow]  (hidden comment: R)
R140  value DNM  [R0402 Reflow]  (hidden comment: R)  (no BOM)
R141  value 1k  [R0402 Reflow]  (hidden comment: R)
TP6  TP  [DualTestpoint 100mils]  (value not drawn)  (no BOM)
TP7  TP  [DualTestpoint 100mils]  (value not drawn)  (no BOM)
TP8  TP  [DualTestpoint 100mils]  (value not drawn)  (no BOM)
TP9  TP  [DualTestpoint 100mils]  (value not drawn)  (no BOM)
U3  U  [QFN4-7x7-56_IRPS5401M]  (value not drawn)  (parts A,B,C,D,E of 5)

### Ports
1V0 (out), 1V8 (out), 2V5 (out), 3V3 (out), 12V0 (in), nPOR_F (out), SMBUS (harness SMBUS)

### Harnesses
SMBUS: ALERT#, CLK, DATA, VDDIO

### Nets
5V0: D9.1(Anode) D10.1(Anode) D11.1(Anode) D12.1(Anode) R120.2 R121.2 R124.2 R125.2 R131.2 R132.2 R138.2 R139.2
GND: C7.2 C8.2 C18.2 C19.2 C20.2 C21.2 C22.2 C23.2 C24.2 C25.2 C26.2 C27.2 C28.2 C29.2 C30.2 C31.2 C32.2 C33.2 C34.2 C35.2 C38.2 C41.2 C42.2 C43.2 C44.2 C45.2 C47.2 C48.2 C49.2 C50.2 C51.2 C52.2 C53.2 C54.2 C56.2 C58.2 C59.2 C60.2 C66.2 C67.2 C68.2 C69.2 Q30.2(S) Q78.2(S) Q79.2(S) Q80.2(S) Q98.2(S) R95.1 R97.1 R122.2 R126.2 R133.2 R134.1 R136.1 R137.1 R140.2 R141.1 TP6.2 TP7.2 TP8.2 TP9.2 U3.22(VIN_LDO) U3.28(EN_L) U3.40(RTN_A) U3.50(AGND) U3.52(SYNC_CLK) U3.57(GND)
Vin: C7.1 C8.1 C18.1 C19.1 C20.1 C21.1 C22.1 C23.1 C38.1 C41.1 C43.1 C44.1 C45.1 C47.1 U3.1(VIN_D) U3.12(VIN_C) U3.32(VIN_B) U3.39(VIN_A) U3.49(VSUPPLY) ; port 12V0  [project net 12V0]
Vout1: C66.1 J5.2 J6.2 ; port 1V0  [project net 1V0]
Vout2: C67.1 J7.2 J8.2 ; port 1V8  [project net 1V8]
Vout3: C68.1 J9.2 J10.2 ; port 2V5  [project net 2V5]
Vout4: C69.1 J11.2 J12.2 ; port 3V3  [project net 3V3]
nRST: Q98.3(D) ; port nPOR_F
PG_A: Q30.1(G) R120.1 U3.26(PG_A)  [project net PG_A_15]
PG_B: Q78.1(G) R124.1 U3.30(PG_B)  [project net PG_B_15]
PG_C: Q79.1(G) R131.1 U3.27(PG_C)  [project net PG_C_15]
PG_D: Q80.1(G) R138.1 U3.16(PG_D)  [project net PG_D_15]
Vcc: C49.1 C50.1 R123.2 U3.29(SLEEP#) U3.48(VCC)  [project net Vcc_15]
NetC24_1: C24.1 C25.1 C26.1 C42.1 J5.1 J6.1 L3.2 R94.2 TP6.1
NetC27_1: C27.1 C28.1 C29.1 C48.1 J7.1 J8.1 L4.2 R96.2 TP7.1
NetC30_1: C30.1 C31.1 C32.1 C56.1 J9.1 J10.1 L5.2 R130.2 TP8.1
NetC33_1: C33.1 C34.1 C35.1 C60.1 J11.1 J12.1 L6.2 R135.2 TP9.1
NetC40_1: C40.1 U3.38(BOOT_A)
NetC40_2: C40.2 L3.1 U3.36(PHASE_A)
NetC46_1: C46.1 U3.33(BOOT_B)
NetC46_2: C46.2 L4.1 U3.34(PHASE_B)
NetC51_1: C51.1 C52.1 R123.1 U3.47(VDRV)
NetC53_1: C53.1 R127.2 R128.2 R129.2 U3.20(VDDIO) ; port SMBUS.VDDIO
NetC54_1: C54.1 U3.21(1V8)
NetC55_1: C55.1 U3.11(BOOT_C)
NetC55_2: C55.2 L5.1 U3.8(PHASE_C)
NetC57_1: C57.1 U3.4(BOOT_D)
NetC57_2: C57.2 L6.1 U3.5(PHASE_D)
NetC58_1: C58.1 R136.2 U3.54(MTP)
NetC59_1: C59.1 R137.2 U3.55(ADDR_PROT)
NetD9_2: D9.2(Cathode) R99.2
NetD10_2: D10.2(Cathode) R101.2
NetD11_2: D11.2(Cathode) R103.2
NetD12_2: D12.2(Cathode) R105.2
NetJ14_5: R127.1 U3.17(ALERT#) ; port SMBUS.ALERT#
NetJ14_7: R128.1 U3.18(CLK) ; port SMBUS.CLK
NetJ14_9: R129.1 U3.19(DATA) ; port SMBUS.DATA
NetQ30_3: Q30.3(D) R99.1
NetQ78_3: Q78.3(D) R101.1
NetQ79_3: Q79.3(D) R103.1
NetQ80_3: Q80.3(D) Q98.1(G) R105.1
NetR94_1: R94.1 R95.2 U3.41(FB_A)
NetR96_1: R96.1 R97.2 U3.31(FB_B)
NetR121_1: R121.1 R122.1 U3.42(EN_A)
NetR125_1: R125.1 R126.1 U3.44(EN_B)
NetR130_1: R130.1 R134.2 U3.15(FB_C)
NetR132_1: R132.1 R133.1 U3.51(EN_C)
NetR135_1: R135.1 R141.2 U3.56(FB_D)
NetR139_1: R139.1 R140.1 U3.53(EN_D)
NetU3_45: U3.45(ISEN_A-) U3.46(ISEN_A+)

Not connected (* = marked no-connect by the designer): U3 23(VO_LDO)* 24(FB_L)* 25(PG_L)* 43(PWM_A)*

### Notes on the sheet
- /
- designed by
- reviewed by
- last drawn by
- Project:
- Schematic:
- last printed
- DIN-A3 L
- sheets
- of
- File:
- (in symbol C) .
- (in symbol C+_TAN) +
- (in symbol C_2) .
- (in symbol C_7) .
- (in symbol C_10) .
- (in symbol C_11) .

### Library data of the parts
C7 C8 C18-C23 C43 = C: CAP CER 10UF 25V X7R 1206; 04. Manufacturer: TDK Corporation; 07. Manufacturer  Part Number: C3216X7R1E106K160AB; Tolerance: ±10%; 03. Unit Price: 0.66; 13. Created Date/Name: AUG2018/Hören; Voltage Rating: 25V; Type: X7R; ComponentLink1Description: Info; ComponentLink1URL: https://www.digikey.de/products/en?keywords=445-7705-6-ND; 02. Distributor Part Number: 445-7705-6-ND; 09. Operating Temperature: -55°C ~ 125°C; 11. RoHS: YES; 01. Distributor: DigiKey; ComponentLink2Description: DataSheet; Package: 1206
C24-C35 = C: CAP CER 47UF 10V X5R 1210; 04. Manufacturer: Samsung Electro-Mechanics; 07. Manufacturer  Part Number: CL32A476MPJNNNE; Tolerance: ±20%; 03. Unit Price: 0.88; 13. Created Date/Name: AUG2018/Hören; Voltage Rating: 10V; Type: X5R; ComponentLink1Description: Info; ComponentLink1URL: *; 02. Distributor Part Number: 1276-3380-6-ND; 09. Operating Temperature: -55°C ~ 85°C; 11. RoHS: YES; 01. Distributor: DigiKey; ComponentLink2Description: DataSheet; Package: 1210
C38 C40-C42 C44-C48 C53 C55-C57 C60 = C: CAP CER 0.1UF 25V X7R 0402; 04. Manufacturer: Yageo; 07. Manufacturer  Part Number: CC0402KRX7R8BB104; Tolerance: ±10%; 03. Unit Price: 0.09; 13. Created Date/Name: AUG2018/Hören; Voltage Rating: 25V; Type: X7R; ComponentLink1Description: Info; ComponentLink1URL: https://www.digikey.de/products/en?keywords=311-2077-6-ND; 02. Distributor Part Number: 311-2077-6-ND; 09. Operating Temperature: -55°C ~ 125°C; 11. RoHS: YES; 01. Distributor: DigiKey; ComponentLink2Description: DataSheet; Package: 0402
C49 C51 = C_11: CAP CER 2.2UF 10V X7R 0805; 04. Manufacturer: Samsung Electro-Mechanics; 07. Manufacturer  Part Number: CL21B225KPFNNNE; 03. Unit Price: 0.11; Voltage Rating: 10V; Type: X7R; ComponentLink1Description: Info; ComponentLink1URL: https://www.digikey.de/products/en?keywords=311-2077-6-ND; 02. Distributor Part Number: 1276-1188-1-ND; 11. RoHS: YES; 01. Distributor: DigiKey; ComponentLink2Description: DataSheet; Package: 0805
C50 C52 = C_7: CAP CER 1000PF 25V X7R 0402; 04. Manufacturer: KEMET; 07. Manufacturer  Part Number: C0402C102K3RACTU; Tolerance: ±10%; 03. Unit Price: 0.09; 13. Created Date/Name: AUG2018/Hören; Voltage Rating: 25V; Type: X7R; ComponentLink1Description: Info; ComponentLink1URL: https://www.digikey.de/products/en?keywords=399-1031-6-ND; 02. Distributor Part Number: 399-1031-6-ND; 09. Operating Temperature: -55°C ~ 125°C; 11. RoHS: YES; 01. Distributor: DigiKey; ComponentLink2Description: DataSheet; Package: 0402
C54 = C_2: CAP CER 1UF 6.3V X7R 0402; 04. Manufacturer: Murata Electronics; 07. Manufacturer  Part Number: GRM155R70J105KA12J; Tolerance: ±10%; 03. Unit Price: 0.11; 13. Created Date/Name: AUG2018/Hören; Voltage Rating: 6.3V; Type: X7R; ComponentLink1Description: Info; ComponentLink1URL: https://www.digikey.de/product-detail/en/murata-electronics/GRM155R70J105KA12J/490-13339-6-ND/5973468; 02. Distributor Part Number: 490-13339-6-ND; 09. Operating Temperature: -55°C ~ 125°C; 11. RoHS: YES; 01. Distributor: DigiKey; ComponentLink2Description: DataSheet; Package: 0402
C58 C59 = C_10: CAP CER 0.01UF 25V X7R 0402; 04. Manufacturer: Murata Electronics; 07. Manufacturer  Part Number: GCM155R71E103KA37D; Tolerance: ±10%; 03. Unit Price: 0.09; Voltage Rating: 25V; Type: X7R; ComponentLink1Description: Info; 02. Distributor Part Number: 490-6043-1-ND; 09. Operating Temperature: -55°C ~ 125°C; 11. RoHS: YES; 01. Distributor: DigiKey; ComponentLink2Description: DataSheet; ComponentLink2URL: https://www.murata.com/~/media/webrenewal/support/library/catalog/products/capacitor/mlcc/c03e.ashx?la=en-us; Package: 0402
  C58: ComponentLink1URL: https://www.digikey.de/products/en?keywords=311-2077-6-ND
  C59: ComponentLink1URL: https://www.digikey.de/product-detail/en/murata-electronics/GCM155R71E103KA37D/490-6043-1-ND/3845243
C66-C69 = C+_TAN: CAP TANT 47UF 20% 10V 1411; 04. Manufacturer: AVX Corporation; 07. Manufacturer  Part Number: F971A476MBAHT3; 03. Unit Price: 0.73; 3D-Export: No; ComponentLink1Description: Info; 02. Distributor Part Number: 478-12531-1-ND; 11. RoHS: YES; 01. Distributor: DigiKey; ComponentLink2Description: DataSheet
D9-D12 = LED: LED GREEN DIFFUSED 0603 SMD; 04. Manufacturer: OSRAM Opto Semiconductors Inc.; 07. Manufacturer  Part Number: LG L29K-G2J1-24-Z; Vf: 1.7V; If: 2mA; Wave Length: 570nm; Viewing Angle: 160°; 03. Unit Price: 0.4; 13. Created Date/Name: AUG2018/Hören; ComponentLink1Description: Info; ComponentLink1URL: https://www.digikey.de/products/en?keywords=475-2709-6-ND; ComponentLink2Description: DataSheet; ComponentLink2URL: https://www.digikey.de/products/en?keywords=475-2709-6-ND; 02. Distributor Part Number: 475-2709-6-ND; 11. RoHS: YES; 01. Distributor: DigiKey
J5-J12 = Jumper SMD: RES SMD 0 OHM JUMPER 1/10W 0603; 04. Manufacturer: Yageo; 07. Manufacturer  Part Number: RC0603JR-070RL; 03. Unit Price: 0.09; 01. Distributor: DigiKey; 02. Distributor Part Number: 311-0.0GRDKR-ND; 09. Operating Temperature: -55°C ~ 155°C; 11. RoHS: YES; Package: 0603; ComponentLink4Description: Info; ComponentLink4URL: https://www.digikey.de/product-detail/en/yageo/RC0603JR-070RL/311-0.0GRDKR-ND/732569; ComponentLink5Description: DataSheet; ComponentLink5URL: http://www.yageo.com/documents/recent/PYu-RC_Group_51_RoHS_L_10.pdf
L3-L6 = INDUCTOR: Fixed Inductors 3.3uH Shld 20% 15.1A 9.42mOhms AECQ2; 04. Manufacturer: Coilcraft; 07. Manufacturer  Part Number: XAL7070-332MEC; Impedance Tolerance: %; 03. Unit Price: 3.05; ComponentLink1Description: Info; ComponentLink1URL: https://www.digikey.de/products/en?keywords=732-1620-6-ND; ComponentLink2Description: DataSheet; ComponentLink2URL: https://www.we-online.de/katalog/datasheet/742792040.pdf; 02. Distributor Part Number: 994-XAL7070-332MEC; 11. RoHS: YES; Tolerance: *; Value: *; 01. Distributor: Mouser
Q30 Q78-Q80 Q98 = FDV303N: as Q77 on sheet Instrument; 01. Distributor: DigiKey; 02. Distributor Part Number: FDV303NDKR-ND; 07. Manufacturer  Part Number: FDV303N; 09. Operating Temperature: -55°C ~ 150°C (TJ); 11. RoHS: YES; ComponentLink1Description: Info; ComponentLink1URL: https://www.digikey.de/product-detail/en/on-semiconductor/FDV303N/FDV303NDKR-ND/1630434; ComponentLink2Description: DataSheet; ComponentLink2URL: https://media.digikey.com/pdf/Data%20Sheets/Fairchild%20PDFs/FDV303N.pdf; Vdss: 25V; Id: 680mA
R94 R96 = R: RES SMD 33 OHM 1% 1/16W 0402; 04. Manufacturer: Yageo; 07. Manufacturer  Part Number: RC0402FR-0733RL; 03. Unit Price: 0.09; 13. Created Date/Name: AUG2018/Hören; Power Rating: 63mW; Tolerance: ±1%; ComponentLink1URL: https://www.digikey.de/products/en?keywords=311-10.0KLRDKR-ND; ComponentLink1Description: Info; 02. Distributor Part Number: 311-33.0LRDKR-ND; 09. Operating Temperature: -55°C ~ 155°C; 11. RoHS: YES; 01. Distributor: DigiKey; ComponentLink2Description: DataSheet; Type: Thick Film; Package: 0402
R95 R97 R120-R122 R124-R134 R136-R140 = R: RES SMD 10K OHM 1% 1/16W 0402; 04. Manufacturer: Yageo; 07. Manufacturer  Part Number: RC0402FR-0710KL; 03. Unit Price: 0.09; 13. Created Date/Name: AUG2018/Hören; Power Rating: 63mW; Tolerance: ±1%; ComponentLink1URL: https://www.digikey.de/products/en?keywords=311-10.0KLRDKR-ND; ComponentLink1Description: Info; 02. Distributor Part Number: 311-10.0KLRDKR-ND; 09. Operating Temperature: -55°C ~ 155°C; 11. RoHS: YES; 01. Distributor: DigiKey; ComponentLink2Description: DataSheet; Type: Thick Film; Package: 0402
R99 R101 R105 = R: RES SMD 3.6K OHM 1% 1/10W 0603; 04. Manufacturer: Yageo; 07. Manufacturer  Part Number: RC0603FR-073K6L; 03. Unit Price: 0.09; 13. Created Date/Name: AUG2018/Hören; Power Rating: 63mW; Tolerance: ±1%; ComponentLink1URL: https://www.digikey.de/product-detail/en/yageo/RC0402FR-071K65L/YAG3043DKR-ND/5282914; ComponentLink1Description: Info; 02. Distributor Part Number: 311-3.60KHRCT-ND; 09. Operating Temperature: -55°C ~ 155°C; 11. RoHS: YES; 01. Distributor: DigiKey; ComponentLink2Description: DataSheet; Type: Thick Film; Package: 0402
R103 = R: RES SMD 1.65K OHM 1% 1/16W 0402; 04. Manufacturer: Yageo; 07. Manufacturer  Part Number: RC0402FR-071K65L; 03. Unit Price: 0.09; 13. Created Date/Name: AUG2018/Hören; Power Rating: 63mW; Tolerance: ±1%; ComponentLink1URL: https://www.digikey.de/product-detail/en/yageo/RC0402FR-071K65L/YAG3043DKR-ND/5282914; ComponentLink1Description: Info; 02. Distributor Part Number: YAG3043DKR-ND; 09. Operating Temperature: -55°C ~ 155°C; 11. RoHS: YES; 01. Distributor: DigiKey; ComponentLink2Description: DataSheet; Type: Thick Film; Package: 0402
R123 = R_24: RES SMD 2.2 OHM 1% 1/16W 0402; 04. Manufacturer: Yageo; 07. Manufacturer  Part Number: RC0402FR-072R2L; 03. Unit Price: 0.09; Power Rating: 0.1W; Tolerance: ±1%; ComponentLink1URL: https://www.digikey.de/product-detail/en/panasonic-electronic-components/ERJ-2RKF15R0X/P15.0LDKR-ND/575530; ComponentLink1Description: Info; 02. Distributor Part Number: 311-2.20LRTR-ND; 11. RoHS: YES; 01. Distributor: DigiKey; ComponentLink2Description: DataSheet; ComponentLink2URL: https://industrial.panasonic.com/cdbs/www-data/pdf/RDA0000/AOA0000C304.pdf; Package: 0402
R135 R141 = R: RES SMD 1K OHM 1% 1/16W 0402; 04. Manufacturer: Yageo; 07. Manufacturer  Part Number: RC0402FR-071KP; 03. Unit Price: 0.09; 13. Created Date/Name: AUG2018/Hören; Power Rating: 63mW; Tolerance: ±1%; ComponentLink1URL: https://www.digikey.de/products/en?keywords=311-10.0KLRDKR-ND; ComponentLink1Description: Info; 02. Distributor Part Number: YAG1254CT-ND; 09. Operating Temperature: -55°C ~ 155°C; 11. RoHS: YES; 01. Distributor: DigiKey; ComponentLink2Description: DataSheet; Type: Thick Film; Package: 0402
TP6-TP9 = DualTestpoint 100mils: as TP3 on sheet Power; 01. Distributor: Samtec Inc.; 02. Distributor Part Number: HMTSW-103-07-G-S-240; 11. RoHS: YES; ComponentLink1Description: Info; ComponentLink1URL: https://www.samtec.com/products/hmtsw-103-07-g-s-240; ComponentLink2Description: DataSheet; ComponentLink2URL: http://suddendocs.samtec.com/catalog_english/hmtsw.pdf
U3 = IRPS5401M: POL - SUPIRBUCK; MFR-PN: IRPS5401MTRPBF; MFR: Infineon; 04. Manufacturer: Infineon Technologies; 03. Unit Price: 6.99; 07. Manufacturer  Part Number: IRPS5401MTRPBF; 01. Distributor: DigiKey; 02. Distributor Part Number: IRPS5401MTRPBFCT-ND; 11. RoHS: YES; ComponentLink4Description: Info; ComponentLink4URL: https://www.digikey.de/products/en?keywords=XC7A15T-1CSG324C; ComponentLink5Description: DataSheet; ComponentLink5URL: https://www.xilinx.com/support/documentation/data_sheets/ds181_Artix_7_Data_Sheet.pdf; ComponentLink6Description: NXP; ComponentLink6URL: https://www.nxp.com/part/MK20DN512VMD10; NicName: IRPS5401M

## Sheet PSU1.SchDoc: PSU1
size A4; Date: JUN 2020; ApprovedBy: Hören; CheckedBy: Mörz; Author: Rudziński; CompanyName: Semi-ATE; DrawnBy: Rudziński; Engineer: Hören; Organization: Semi-ATE; DocumentNumber: 14; Revision: V1.0; SheetNumber: 14; SheetTotal: 20
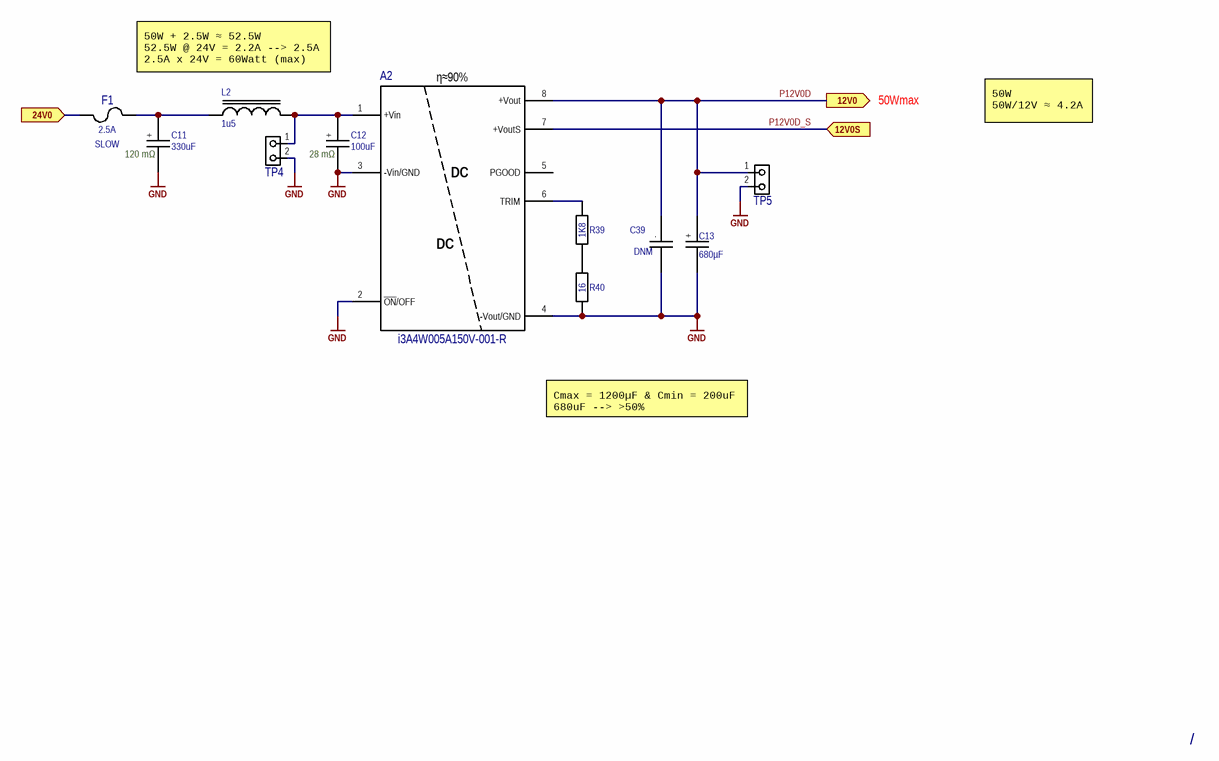
[diagram p4: PSU1.SchDoc]

### Parts
A2  Efficiency: η≈90%  [I3A-POSETIVE]  (hidden comment: A)
C11  value 330uF  ESR: 120 mΩ  [SMD-CAP-ALU-G]  (hidden comment: C+)
C12  value 100uF  ESR: 28 mΩ  [SMD-CAP-ALU-G]  (hidden comment: C+)
C13  value 680µF  [CAP_EL_KE0]  (hidden comment: C+)
C39  value DNM  [C0402 Reflow]  (hidden comment: C)  (no BOM)
F1  value 2.5A  Speed: SLOW  [OMNI-Fuse]  (hidden comment: F)
L2  Inductance: 1u5  [XAL4020]  (hidden comment: L)
R39  value 1K8  [R0603 Reflow]  (hidden comment: R)
R40  value 16  [R0603 Reflow]  (hidden comment: R)
TP4  TP  [DualTestpoint 100mils]  (value not drawn)  (no BOM)
TP5  TP  [DualTestpoint 100mils]  (value not drawn)  (no BOM)

### Ports
12V0 (out), 12V0S (in), 24V0 (in)

### Nets
24V0: F1.1 ; port 24V0
GND: A2.2(~{ON}/OFF) A2.3(-Vin/GND) A2.4(-Vout/GND) C11.2 C12.2 C13.2 C39.2 R40.1 TP4.2 TP5.2
P12V0D: A2.8(+Vout) C13.1 C39.1 TP5.1 ; port 12V0  [project net 12V0]
P12V0D_S: A2.7(+VoutS) ; port 12V0S
NetA2_1: A2.1(+Vin) C12.1 L2.1 TP4.1
NetA2_6: A2.6(TRIM) R39.2
NetC11_1: C11.1 F1.2 L2.2
NetR39_1: R39.1 R40.2

Not connected (* = marked no-connect by the designer): A2 5(PGOOD)

### Notes on the sheet
- 50W + 2.5W ≈ 52.5W
  52.5W @ 24V = 2.2A --> 2.5A
  2.5A x 24V = 60Watt (max)
- 50Wmax
- 50W
  50W/12V ≈ 4.2A
- Cmax = 1200µF & Cmin = 200uF
  680uF --> >50%
- /
- designed by
- reviewed by
- last drawn by
- Project:
- Schematic:
- last printed
- DIN-A4 L
- sheets
- of
- File:
- (in symbol C) .
- (in symbol C+) +
- (in symbol i3A4W005A150V-001-R) DC

### Library data of the parts
A2 = i3A4W005A150V-001-R: DC DC CONVERTER 5-30V 135W; 04. Manufacturer: TDK-Lambda Americas Inc.; 03. Unit Price: 20.18; 13. Created Date/Name: AUG 2018 / Hören; 01. Distributor: Digi-Key; 02. Distributor Part Number: 285-2719-ND; 07. Manufacturer  Part Number: I3A4W005A150V-001-R; ComponentLink1Description: Info; ComponentLink1URL: https://www.digikey.de/products/en/power-supplies-board-mount/dc-dc-converters/922?k=i3A4W005A150V; ComponentLink2Description: DataSheet; ComponentLink2URL: https://www.us.tdk-lambda.com/ftp/specs/i3a_full_datasheet.pdf?ref_disty=digikey; NicName: i3A4W005A150V-001-R
C11 = C+: CAP ALUM 330UF 20% 50V SMD; 04. Manufacturer: Panasonic Electronic Components; 07. Manufacturer  Part Number: EEE-FT1H331AP; 03. Unit Price: 0.96; 13. Created Date/Name: AUG2018/Hören; 3D-Export: No; ComponentLink1Description: Info; ComponentLink1URL: https://www.digikey.de/product-detail/en/panasonic-electronic-components/EEE-FT1H331AP/PCE5026DKR-ND/2652105; Tolerance: ±20%; Voltage Rating: 50V; 02. Distributor Part Number: PCE5026DKR-ND; 09. Operating Temperature: -55°C ~ 105°C; 11. RoHS: YES; 01. Distributor: DigiKey; ComponentLink2Description: DataSheet; ComponentLink2URL: https://industrial.panasonic.com/cdbs/www-data/pdf/RDE0000/ABA0000C1240.pdf
C12 = C+: CAP ALUM POLY HYB 100UF 50V SMD; 04. Manufacturer: Panasonic Electronic Components; 07. Manufacturer  Part Number: EEH-ZA1H101P; Tolerance: ±20%; 03. Unit Price: 2.5; 13. Created Date/Name: AUG2018/Hören; 3D-Export: No; ComponentLink1Description: Info; ComponentLink1URL: https://www.digikey.de/product-detail/en/panasonic-electronic-components/EEH-ZA1H101P/P15442DKR-ND/3088152; Voltage Rating: 50V; 02. Distributor Part Number: P15442DKR-ND; 09. Operating Temperature: -55°C ~ 105°C; 11. RoHS: YES; 01. Distributor: DigiKey; ComponentLink2Description: DataSheet; ComponentLink2URL: https://industrial.panasonic.com/cdbs/www-data/pdf/RDD0000/ABA0000C1221.pdf
C13 = C+: CAP ALUM 680UF 20% 50V SMD; 04. Manufacturer: Panasonic Electronic Components; 07. Manufacturer  Part Number: EEV-FK1V681Q; ESR: 60 mΩ; Voltage Rating: 35V; Type: Radial, Can - SMD; 03. Unit Price: 1.25; Lifetime @ Temp: 5000 Hrs @ 105°C; 3D-Export: No; ComponentLink1Description: Info; ComponentLink1URL: https://www.digikey.de/product-detail/en/panasonic-electronic-components/EEV-FK1H681M/PCE3523DKR-ND/1838505; Tolerance: ±20%; 02. Distributor Part Number: PCE3465CT-ND; 09. Operating Temperature: -55°C ~ 105°C; 11. RoHS: YES; 01. Distributor: DigiKey; ComponentLink2Description: DataSheet; ComponentLink2URL: https://industrial.panasonic.com/cdbs/www-data/pdf/RDE0000/ABA0000C1181.pdf; Package: Ø12.5 mm x 13.5mm
C39 = C: CAP CER 0.1UF 16V X7R 0402; 04. Manufacturer: KEMET; 07. Manufacturer  Part Number: C0402C104J4RACTU; Tolerance: ±5%; 03. Unit Price: 0.45; 13. Created Date/Name: AUG2018/Hören; Voltage Rating: 16V; Type: X7R; ComponentLink1Description: Info; ComponentLink1URL: https://www.digikey.de/product-detail/en/kemet/C0402C104J4RACTU/399-7761-6-ND/3472292; 02. Distributor Part Number: 399-7761-6-ND; 09. Operating Temperature: -55°C ~ 125°C; 11. RoHS: YES; 01. Distributor: DigiKey; ComponentLink2Description: DataSheet; ComponentLink2URL: https://content.kemet.com/datasheets/KEM_C1002_X7R_SMD.pdf; Package: 0402
F1 = Fuse: FUSE BRD MNT 2.5A 125VAC/VDC SMD; 04. Manufacturer: Littelfuse Inc.; 07. Manufacturer  Part Number: 015402.5DRT; 03. Unit Price: 2.75; 13. Created Date/Name: AUG 2018 / Hören; 3D-Export: No; 01. Distributor: DigiKey; 02. Distributor Part Number: F1306DKR-ND; 09. Operating Temperature: -55°C ~ 125°C; 11. RoHS: YES; ComponentLink1Description: Info; ComponentLink1URL: https://www.digikey.de/products/en/circuit-protection/fuses/139?k=&pkeyword=&sv=0&pv7=243&sf=0&FV=ffec3b86%2Cffec4f0c%2Cffec8a72%2Cffec8a73%2Cfffc0012%2C55c00d7%2C1f140000%2Cffe0008b%2Cmu2.5A%7C2088&quantity=&ColumnSort=0&page=1&pageSize=25; ComponentLink2Description: DataSheet; ComponentLink2URL: https://www.littelfuse.com/~/media/electronics/datasheets/fuses/littelfuse_fuse_154_154t_154l_154tl_datasheet.pdf.pdf
L2 = INDUCTOR: Fixed Inductors 1.5uH Shld 20% 7.5A 23.6mOhms AECQ2; 04. Manufacturer: Coilcraft; 07. Manufacturer  Part Number: XAL4020-152MEC; Impedance Tolerance: %; 03. Unit Price: 1.75; ComponentLink1Description: Info; ComponentLink1URL: https://www.digikey.de/products/en?keywords=732-1620-6-ND; ComponentLink2Description: DataSheet; ComponentLink2URL: https://www.we-online.de/katalog/datasheet/742792040.pdf; 02. Distributor Part Number: 994-XAL4020-152MEC; 11. RoHS: YES; Tolerance: *; Value: *; 01. Distributor: Mouser
R39 = R: RES SMD 1.8K OHM 1% 1/16W 0402; 04. Manufacturer: Yageo; 07. Manufacturer  Part Number: RC0402FR-071K8L; 03. Unit Price: 0.09; 13. Created Date/Name: AUG2018/Hören; Power Rating: 200mW; 3D-Export: No; Tolerance: ±1%; ComponentLink1URL: https://www.digikey.de/product-detail/en/panasonic-electronic-components/ERJ-PB3B1801V/P19999DKR-ND/6215726; ComponentLink1Description: Info; 02. Distributor Part Number: 311-1.80KLRCT-ND; 09. Operating Temperature: -55°C ~ 155°C; 11. RoHS: YES; 01. Distributor: DigiKey; ComponentLink2Description: DataSheet; ComponentLink2URL: https://industrial.panasonic.com/cdbs/www-data/pdf/RDM0000/AOA0000C328.pdf; Package: 0603
R40 = R: RES SMD 16 OHM 1% 1/10W 0603; 04. Manufacturer: Yageo; 07. Manufacturer  Part Number: RC0603FR-0716RL; 03. Unit Price: 0.09; 13. Created Date/Name: AUG2018/Hören; Power Rating: 100mW; 3D-Export: No; Tolerance: ±1%; ComponentLink1URL: https://www.digikey.de/product-detail/en/yageo/RC0603FR-0716R2L/311-16.2HRDKR-ND/732860; ComponentLink1Description: Info; 02. Distributor Part Number: 311-16.0HRDKR-ND; 09. Operating Temperature: -55°C ~ 155°C; 11. RoHS: YES; 01. Distributor: DigiKey; ComponentLink2Description: DataSheet; ComponentLink2URL: http://www.yageo.com/documents/recent/PYu-RC_Group_51_RoHS_L_10.pdf; Type: Thick Film; Package: 0603
TP4 TP5 = DualTestpoint 100mils: as TP3 on sheet Power; 01. Distributor: Samtec Inc.; 02. Distributor Part Number: HMTSW-103-07-G-S-240; 11. RoHS: YES; ComponentLink1Description: Info; ComponentLink1URL: https://www.samtec.com/products/hmtsw-103-07-g-s-240; ComponentLink2Description: DataSheet; ComponentLink2URL: http://suddendocs.samtec.com/catalog_english/hmtsw.pdf